# Altium schematic sheet SH6 - BRUSHED MOTOR CONTROLLER.SchDoc: Brushed Motor Controller
size B; CheckedBy: Wolfgang Windholtz; Engineer: Kyle Hong; Revision: 1.0; SheetNumber: 6; SheetTotal: 7
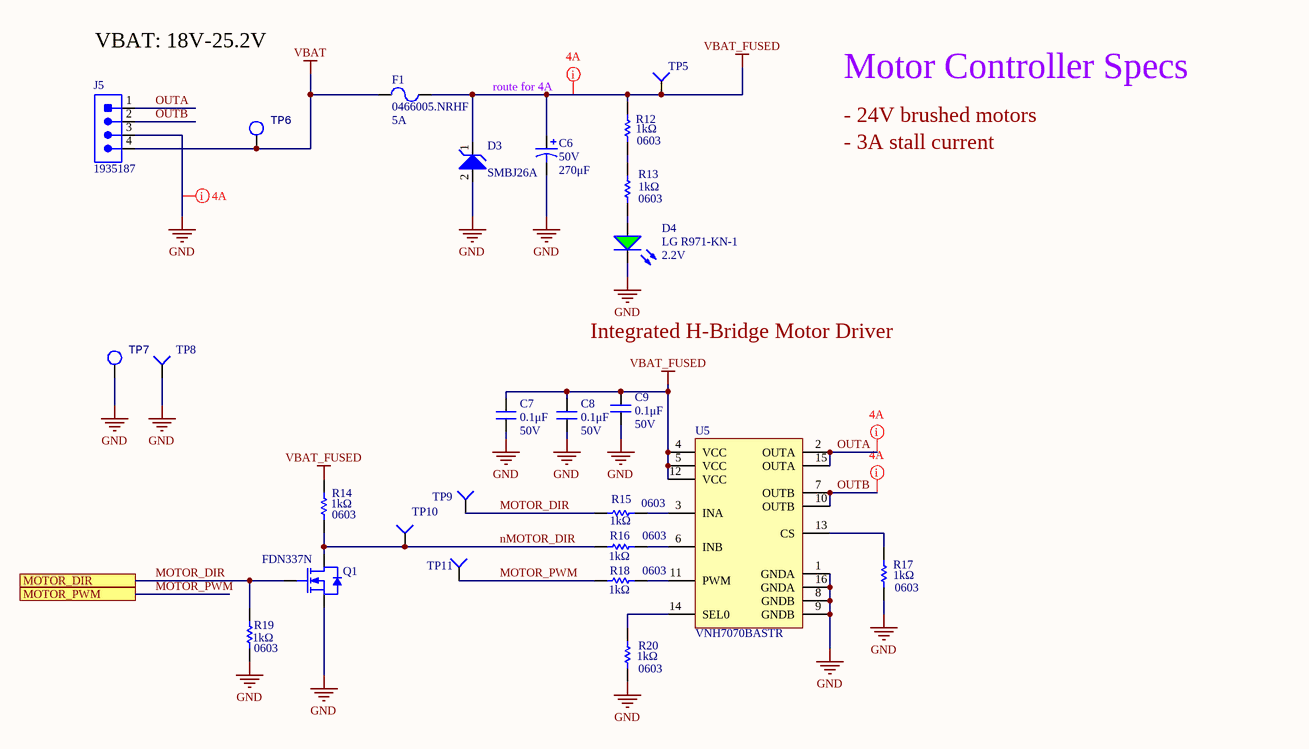
[diagram p0: SH6 - BRUSHED MOTOR CONTROLLER.SchDoc]

## Parts
C6  value 270μF  Voltage Rating: 50V  [RADIAL_PANASONIC_G]  (hidden comment: CAP_270uF_50V_ALUM)
C7  value 0.1μF  Voltage Rating: 50V  [CAP0603]  (hidden comment: CAP_0.1uF_50V_0603)
C8  value 0.1μF  Voltage Rating: 50V  [CAP0603]  (hidden comment: CAP_0.1uF_50V_0603)
C9  value 0.1μF  Voltage Rating: 50V  [CAP0603]  (hidden comment: CAP_0.1uF_50V_0603)
D3  Manufacturer Part Number 1: SMBJ26A  [TVS_DIODE_UNIDIRECTIONAL_SMB]  (hidden comment: TVS_DIODE_UNIDIR_26V)
D4  Forward Voltage Drop: 2.2V  Manufacturer Part Number 1: LG R971-KN-1  [LED_0805_GREEN]  (hidden comment: LED_GREEN)
F1  Manufacturer Part Number 1: 0466005.NRHF  Current Rating: 5A  [FUSE_1206]  (hidden comment: FUSE_5A_1206)
J5  CON_4M_TERM  [1935187]  (value not drawn)
Q1  Manufacturer Part Number 1: FDN337N  [NMOS_SSOT-3]  (hidden comment: NMOS_30V_2.2A)
R12  value 1kΩ  Package/Footprint: 0603  [RESC0603]  (hidden comment: RES_1kΩ_0603_5%)
R13  value 1kΩ  Package/Footprint: 0603  [RESC0603]  (hidden comment: RES_1kΩ_0603_5%)
R14  value 1kΩ  Package/Footprint: 0603  [RESC0603]  (hidden comment: RES_1kΩ_0603_5%)
R15  value 1kΩ  Package/Footprint: 0603  [RESC0603]  (hidden comment: RES_1kΩ_0603_5%)
R16  value 1kΩ  Package/Footprint: 0603  [RESC0603]  (hidden comment: RES_1kΩ_0603_5%)
R17  value 1kΩ  Package/Footprint: 0603  [RESC0603]  (hidden comment: RES_1kΩ_0603_5%)
R18  value 1kΩ  Package/Footprint: 0603  [RESC0603]  (hidden comment: RES_1kΩ_0603_5%)
R19  value 1kΩ  Package/Footprint: 0603  [RESC0603]  (hidden comment: RES_1kΩ_0603_5%)
R20  value 1kΩ  Package/Footprint: 0603  [RESC0603]  (hidden comment: RES_1kΩ_0603_5%)
TP5  TESTPOINT_1MM_CIRCLE  [TESTPOINT_CIRCLE_1MM]  (value not drawn)  (no BOM)
TP6  TESTPOINT_LOOP  [TESTPOINT_LOOP]  (value not drawn)
TP7  TESTPOINT_LOOP  [TESTPOINT_LOOP]  (value not drawn)
TP8  TESTPOINT_1MM_SQUARE  [TESTPOINT_SQUARE_1MM]  (value not drawn)  (no BOM)
TP9  TESTPOINT_1MM_CIRCLE  [TESTPOINT_CIRCLE_1MM]  (value not drawn)  (no BOM)
TP10  TESTPOINT_1MM_CIRCLE  [TESTPOINT_CIRCLE_1MM]  (value not drawn)  (no BOM)
TP11  TESTPOINT_1MM_CIRCLE  [TESTPOINT_CIRCLE_1MM]  (value not drawn)  (no BOM)
U5  Manufacturer Part Number 1: VNH7070BASTR  [SO-16N]  (hidden comment: IC_MOTOR_DRIVER_ST)

## Ports
MOTOR_DIR, MOTOR_PWM

## Nets
GND: C6.2 C7.1 C8.1 C9.2 D3.2(Anode) D4.2(K) J5.3 Q1.2(SOURCE) R17.1 R19.1 R20.1 TP7.1 TP8.1(=value) U5.1(GNDA) U5.8(GNDB) U5.9(GNDB) U5.16(GNDA)
VBAT: F1.1 J5.4 TP6.1
VBAT_FUSED: C6.1 C7.2 C8.2 C9.1 D3.1(Cathode) F1.2 R12.2 R14.2 TP5.1(=value) U5.4(VCC) U5.5(VCC) U5.12(VCC)
MOTOR_DIR: Q1.1(GATE) R15.1 R19.2 TP9.1(=value) ; port MOTOR_DIR
MOTOR_PWM: R18.1 TP11.1(=value) ; port MOTOR_PWM
nMOTOR_DIR: Q1.3(DRAIN) R14.1 R16.1 TP10.1(=value)
OUTA: J5.1 U5.2(OUTA) U5.15(OUTA)
OUTB: J5.2 U5.7(OUTB) U5.10(OUTB)
NetD4_1: D4.1(A) R13.1
NetR12_1: R12.1 R13.2
NetR15_2: R15.2 U5.3(INA)
NetR16_2: R16.2 U5.6(INB)
NetR17_2: R17.2 U5.13(CS)
NetR18_2: R18.2 U5.11(PWM)
NetR20_2: R20.2 U5.14(SEL0)

## Layout directives
mark named 4A: GND, OUTA, OUTB, VBAT_FUSED

## Notes on the sheet
- VBAT: 18V-25.2V
- route for 4A
- Motor Controller Specs
- - 24V brushed motors
- - 3A stall current
- Integrated H-Bridge Motor Driver
- Title:
- Project:
- Date:
- Rev:
- Checker:
- Engineer:
- Sheet:
- of

## Library data of the parts
C6 = CAP_270uF_50V_ALUM: CAP ALUM 270uF 50VDC 20% SMD; Manufacturer 1: Panasonic Electronic Components; Manufacturer Part Number 1: EEE-FN1H271UP; Supplier 1: Digi-Key; Supplier Part Number 1: 10-EEE-FN1H271UPCT-ND; Mounting Type: SMD; Package/Footprint: SMD
C7-C9 = CAP_0.1uF_50V_0603: CAP CER 0.1UF 50V X7R 0603; Manufacturer Part Number 1: CC0603KRX7R9BB104; Manufacturer 1: Yageo; Package/Footprint: 0603; Supplier Part Number 1: 311-1344-1-ND; Supplier 1: Digi-Key; Dielectric: X7R; Mounting Type: SMD
D3 = TVS_DIODE_UNIDIR_26V: TVS DIODE 26V 42.1V SMB; Manufacturer 1: Littelfuse; Supplier 1: Digi-Key; Supplier Part Number 1: SMBJ26ALFCT-ND; Package/Footprint: SMB; Mounting Type: SMD; Verified: No
D4 = LED_GREEN: LED GREEN DIFFUSED 0805 SMD; Manufacturer 1: OSRAM; Package/Footprint: 0805; Supplier Part Number 1: 475-1410-1-ND; Supplier 1: Digi-Key; Mounting Type: SMD
F1 = FUSE_5A_1206: FUSE BOARD MNT 5A 32VAC/VDC 1206; Manufacturer 1: Littelfuse; Package/Footprint: 1206; Supplier 1: Digi-Key; Supplier Part Number 1: F6019CT-ND; Mounting Type: SMD
J5 = CON_4M_TERM: TERM BLK 4POS SIDE ENTRY 5MM PCB; Manufacturer 1: Phoenix Contact; Wire Gauge: 12-26AWG; Screw Thread: M2.6; Package/Footprint: TH; Manufacturer Part Number 1: 1935187; Supplier Part Number 1: 277-1579-ND; Supplier 1: Digi-Key; Pitch: 5mm; Mounting Type: TH
Q1 = NMOS_30V_2.2A: MOSFET N-CH 30V 2.2A SUPERSOT3; Manufacturer 1: ON Semiconductor / Fairchild; Package/Footprint: SuperSOT-3; Vgs (Max): ±8V; Supplier Part Number 1: FDN337NCT-ND; Supplier 1: Digi-Key; Mounting Type: SMD; Id: 2.2A; Vdss: 30V; Verified: No
R12-R20 = RES_1kΩ_0603_5%: RES 1K OHM 5% 1/10W 0603; Manufacturer 1: Yageo; Manufacturer Part Number 1: RC0603JR-071KL; Supplier Part Number 1: 311-1.0KGRCT-ND; Supplier 1: Digi-Key; Mounting Type: SMD
TP5 TP9-TP11 = TESTPOINT_1MM_CIRCLE: TESTPOINT 1MM CIRCLE
TP6 TP7 = TESTPOINT_LOOP: TESTPOINT THRUHOLE; Manufacturer 1: Keystone Electronics; Manufacturer Part Number 1: 5002; Package/Footprint: TH; Supplier Part Number 1: 36-5002-ND; Supplier 1: Digi-Key; Mounting Type: TH
TP8 = TESTPOINT_1MM_SQUARE: TESTPOINT 1MM SQUARE
U5 = IC_MOTOR_DRIVER_ST: IC MOTOR DRIVER 4V-28V 16SOIC; Manufacturer 1: STMicroelectronics; Output Current: 15A; Package/Footprint: 16-SOIC; Supplier 1: Digi-Key; Supplier Part Number 1: 497-17628-1-ND; Mounting Type: SMD; Verified: Yes